# Altium schematic sheet AHRS.SchDoc: AHRS.SchDoc
size A4; CheckedBy: fx; Author: flotox@yeah.net; Revision: v1.0.0; SheetNumber: 6; SheetTotal: 10
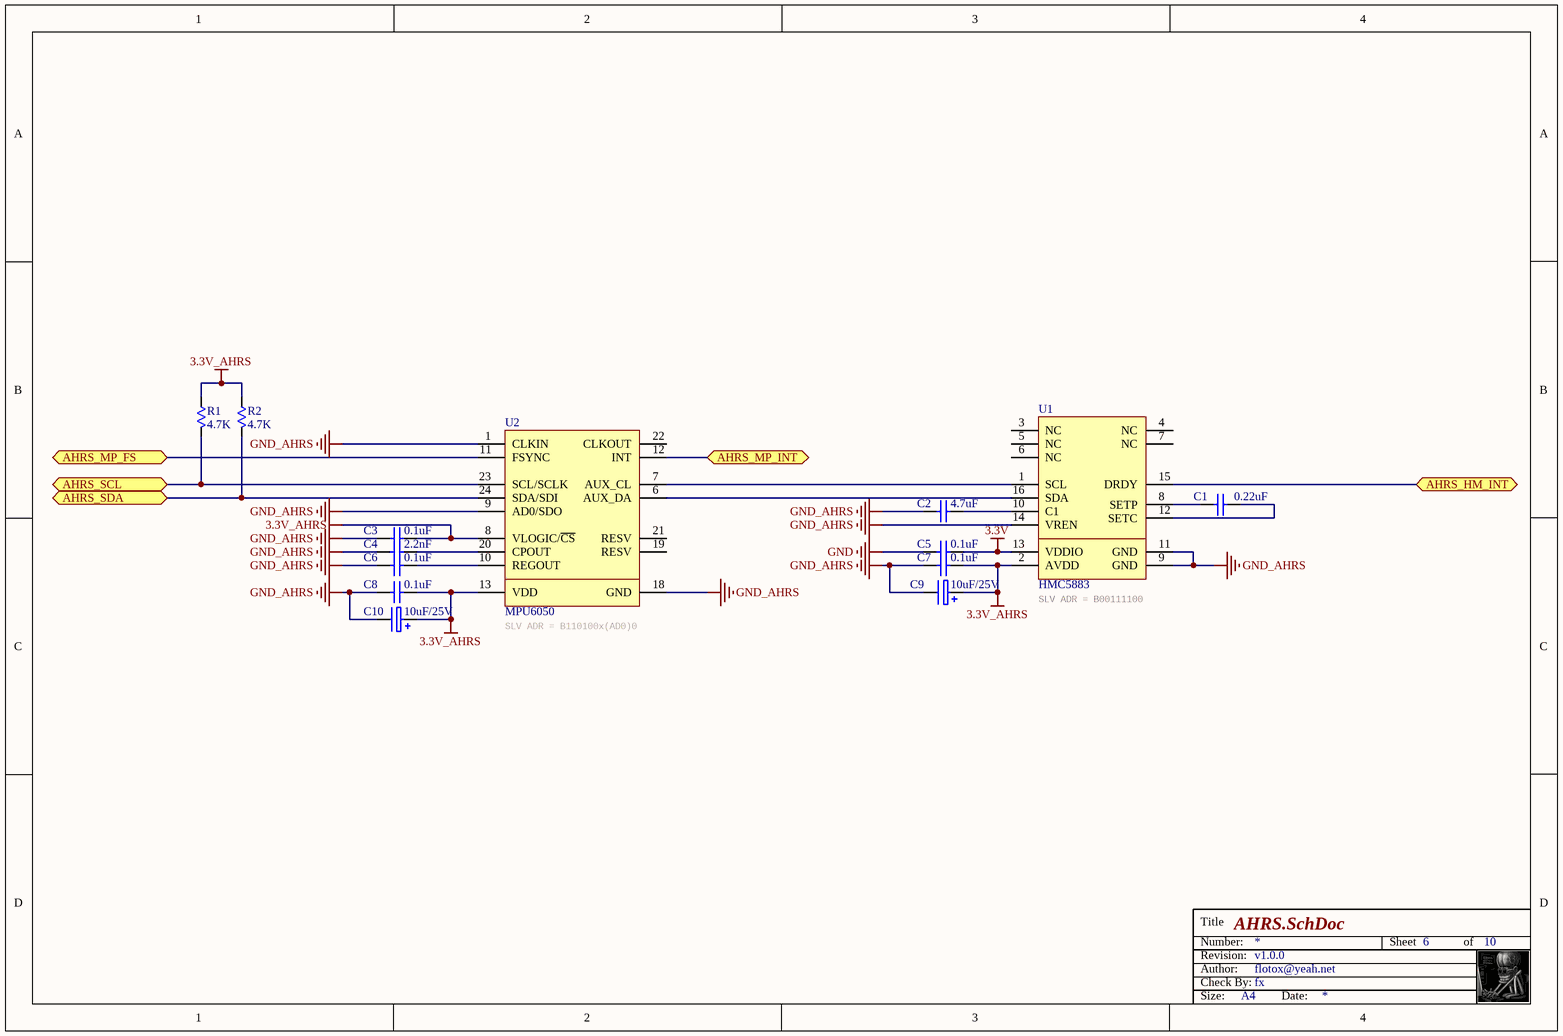
[diagram p0: AHRS.SchDoc]

## Parts
C1  0.22uF  [C0603-S]
C2  4.7uF  [C0603-S]
C3  0.1uF  [C0603-S]
C4  2.2nF  [C0603-S]
C5  0.1uF  [C0603-S]
C6  0.1uF  [C0603-S]
C7  0.1uF  [C0603-S]
C8  0.1uF  [C0603-S]
C9  10uF/25V  [TC3528-1411]
C10  10uF/25V  [TC3528-1411]
R1  4.7K  [R0603-S]
R2  4.7K  [R0603-S]
U1  HMC5883  [QFN50P300X300-16]
U2  MPU6050  [QFN50P400X400-24]

## Ports
AHRS_HM_INT, AHRS_MP_FS, AHRS_MP_INT, AHRS_SCL, AHRS_SDA

## Nets
3.3V: C5.1 U1.13(VDDIO)
3.3V_AHRS: C3.1 C7.1 C8.2 C9.1 C10.1 R1.2 R2.2 U1.2(AVDD) U2.8(VLOGIC/~{CS}) U2.13(VDD)
GND: C5.2
GND_AHRS: C2.2 C3.2 C4.2 C6.1 C7.2 C8.1 C9.2 C10.2 U1.9(GND) U1.11(GND) U1.14(VREN) U2.1(CLKIN) U2.9(AD0/SDO) U2.18(GND)
AHRS_HM_INT: U1.15(DRDY) ; port AHRS_HM_INT
AHRS_MP_FS: U2.11(FSYNC) ; port AHRS_MP_FS
AHRS_MP_INT: U2.12(INT) ; port AHRS_MP_INT
AHRS_SCL: R1.1 U2.23(SCL/SCLK) ; port AHRS_SCL
AHRS_SDA: R2.1 U2.24(SDA/SDI) ; port AHRS_SDA
NetC1_1: C1.1 U1.12(SETC)
NetC1_2: C1.2 U1.8(SETP)
NetC2_1: C2.1 U1.10(C1)
NetC4_1: C4.1 U2.20(CPOUT)
NetC6_2: C6.2 U2.10(REGOUT)
NetU1_1: U1.1(SCL) U2.7(AUX_CL)
NetU1_16: U1.16(SDA) U2.6(AUX_DA)

Not connected (* = marked no-connect by the designer): U1 3(NC) 4(NC) 5(NC) 6(NC) 7(NC); U2 19(RESV) 21(RESV) 22(CLKOUT)

## Notes on the sheet
- (near U2) SLV ADR = B110100x(AD0)0
- (near U1) SLV ADR = B00111100
- Title
- Revision:
- Number:
- Author:
- Check By:
- Sheet
- of
- Size:
- A4
- Date:

## Library data of the parts
C1-C8 = CAP: Capacitor
C9 C10 = CAP-ELEC: Polarized Capacitor
R1 R2 = RES: Resistor
U1 = HMC5883L: 3-Axis Digital Compass IC
U2 = MPU60x0: 6-axis  MotionTracking  device